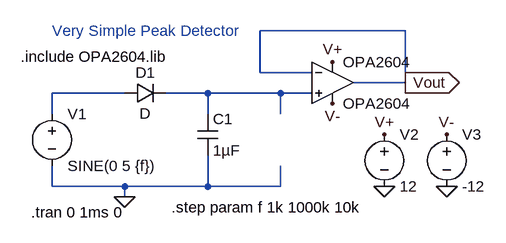
[diagram p0: schematic PeakDetectorSimple.asc]
PeakDetectorSimple.asc, the LTspice schematic file:
Version 4
SHEET 1 880 680
WIRE 576 -16 352 -16
WIRE 352 48 352 -16
WIRE 432 48 352 48
WIRE 576 64 576 -16
WIRE 576 64 496 64
WIRE 144 80 32 80
WIRE 272 80 208 80
WIRE 384 80 272 80
WIRE 432 80 384 80
WIRE 32 112 32 80
WIRE 272 112 272 80
WIRE 384 112 384 80
WIRE 32 224 32 192
WIRE 144 224 32 224
WIRE 272 224 272 176
WIRE 272 224 144 224
WIRE 384 224 384 192
WIRE 384 224 272 224
WIRE 144 240 144 224
FLAG 144 240 0
FLAG 576 64 Vout
IOPIN 576 64 Out
FLAG 544 144 V+
FLAG 640 144 V-
FLAG 544 224 0
FLAG 640 224 0
FLAG 464 32 V+
FLAG 464 96 V-
SYMBOL voltage 32 96 R0
WINDOW 123 0 0 Left 0
WINDOW 39 0 0 Left 0
SYMATTR InstName V1
SYMATTR Value SINE(0 5 {f})
SYMBOL cap 256 112 R0
SYMATTR InstName C1
SYMATTR Value 1µF
SYMBOL diode 144 96 R270
WINDOW 0 32 32 VTop 2
WINDOW 3 0 32 VBottom 2
SYMATTR InstName D1
SYMBOL OpAmps\\opamp2 464 0 R0
SYMATTR InstName OPA2604
SYMATTR Value OPA2604
SYMBOL voltage 544 128 R0
SYMATTR InstName V2
SYMATTR Value 12
SYMBOL voltage 640 128 R0
SYMATTR InstName V3
SYMATTR Value -12
TEXT 0 264 Left 2 !.tran 0 1ms 0
TEXT 32 -16 Left 2 ;Very Simple Peak Detector
TEXT -16 24 Left 2 !.include OPA2604.lib
TEXT 216 256 Left 2 !.step param f 1k 1000k 10k

The netlist it stands for:
* PeakDetectorSimple.asc
V1 N001 0 SINE(0 5 {f})
C1 N002 0 1µF
D1 N001 N002 D
XOPA2604 N002 Vout V+ V- Vout OPA2604  ; pins In+ In- V+ V- OUT
V2 V+ 0 12
V3 V- 0 -12
.model D D
.lib standard.dio
.tran 0 1ms 0
* Very Simple Peak Detector
.include OPA2604.lib
.step param f 1k 1000k 10k
.backanno
.end